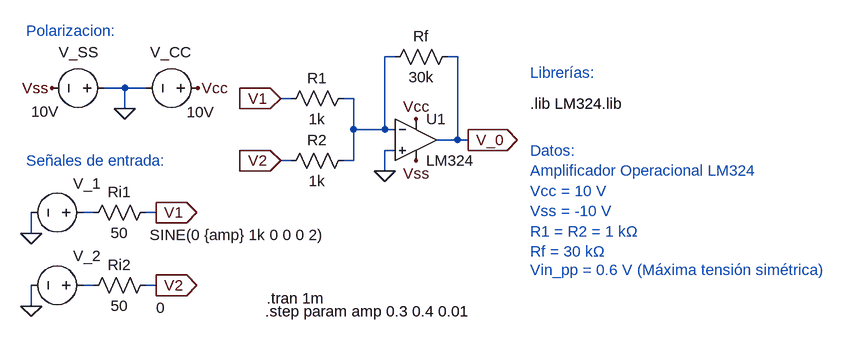
[diagram p0: schematic Lab_2_Circ_1_Ri=50+Barrido Distorsion.asc]
Lab_2_Circ_1_Ri=50+Barrido Distorsion.asc, the LTspice schematic file:
Version 4
SHEET 1 2792 680
WIRE 448 -304 432 -304
WIRE 544 -304 528 -304
WIRE 32 -256 0 -256
WIRE 64 -256 32 -256
WIRE 288 -240 272 -240
WIRE 384 -240 368 -240
WIRE 32 -224 32 -256
WIRE 384 -192 384 -240
WIRE 432 -192 432 -304
WIRE 432 -192 384 -192
WIRE 448 -192 432 -192
WIRE 544 -176 544 -304
WIRE 544 -176 512 -176
WIRE 560 -176 544 -176
WIRE 448 -160 432 -160
WIRE 288 -144 272 -144
WIRE 384 -144 384 -192
WIRE 384 -144 368 -144
WIRE 432 -128 432 -160
WIRE -16 -64 -32 -64
WIRE 80 -64 64 -64
WIRE -112 -32 -112 -64
WIRE -16 48 -32 48
WIRE 80 48 64 48
WIRE -112 80 -112 48
FLAG 432 -128 0
FLAG 144 -256 Vcc
FLAG 480 -208 Vcc
FLAG -80 -256 Vss
FLAG 480 -144 Vss
FLAG 32 -224 0
FLAG -112 -32 0
FLAG 272 -240 V1
IOPIN 272 -240 In
FLAG 80 -64 V1
IOPIN 80 -64 Out
FLAG 272 -144 V2
IOPIN 272 -144 In
FLAG 560 -176 V_0
IOPIN 560 -176 Out
FLAG -112 80 0
FLAG 80 48 V2
IOPIN 80 48 Out
SYMBOL OpAmps\\opamp2 480 -240 R0
SYMATTR InstName U1
SYMATTR Value LM324
SYMBOL res -32 -48 R270
WINDOW 0 32 56 VTop 2
WINDOW 3 0 56 VBottom 2
SYMATTR InstName Ri1
SYMATTR Value 50
SYMBOL voltage -16 -64 M270
WINDOW 0 45 31 VLeft 2
WINDOW 3 -34 -86 VLeft 2
WINDOW 123 -35 -94 VLeft 2
WINDOW 39 0 0 Left 0
SYMATTR InstName V_1
SYMATTR Value SINE(0 {amp} 1k 0 0 0 2)
SYMBOL voltage 160 -256 R90
WINDOW 0 -55 25 VRight 2
WINDOW 3 37 -10 VRight 2
WINDOW 123 0 0 Left 0
WINDOW 39 0 0 Left 0
SYMATTR InstName V_CC
SYMATTR Value 10V
SYMBOL voltage 16 -256 R90
WINDOW 0 -55 25 VRight 2
WINDOW 3 36 85 VRight 2
WINDOW 123 0 0 Left 0
WINDOW 39 0 0 Left 0
SYMATTR InstName V_SS
SYMATTR Value 10V
SYMBOL res -32 64 R270
WINDOW 0 32 56 VTop 2
WINDOW 3 0 56 VBottom 2
SYMATTR InstName Ri2
SYMATTR Value 50
SYMBOL voltage -16 48 M270
WINDOW 0 45 31 VLeft 2
WINDOW 3 -35 -96 VLeft 2
WINDOW 123 0 0 Left 0
WINDOW 39 0 0 Left 0
SYMATTR InstName V_2
SYMATTR Value 0
SYMBOL res 384 -256 R90
WINDOW 0 0 56 VBottom 2
WINDOW 3 32 56 VTop 2
SYMATTR InstName R1
SYMATTR Value 1k
SYMBOL res 384 -160 R90
WINDOW 0 0 56 VBottom 2
WINDOW 3 32 56 VTop 2
SYMATTR InstName R2
SYMATTR Value 1k
SYMBOL res 544 -320 R90
WINDOW 0 0 56 VBottom 2
WINDOW 3 32 56 VTop 2
SYMATTR InstName Rf
SYMATTR Value 30k
TEXT 656 -232 Left 2 !.lib LM324.lib
TEXT 656 -280 Left 2 ;Librerías:
TEXT -120 -344 Left 2 ;Polarizacion:
TEXT -120 -144 Left 2 ;Señales de entrada:
TEXT 656 -160 Left 2 ;Datos:\nAmplificador Operacional LM324\nVcc = 10 V\nVss = -10 V\nR1 = R2 = 1 kΩ\nRf = 30 kΩ
TEXT 248 88 Left 2 !.step param amp 0.3 0.4 0.01
TEXT 656 24 Left 2 ;Vin_pp = 0.6 V (Máxima tensión simétrica)
TEXT 250 68 Left 2 !.tran 1m

The netlist it stands for:
* Lab_2_Circ_1_Ri=50+Barrido Distorsion.asc
XU1 0 N001 Vcc Vss V_0 LM324  ; pins In+ In- V+ V- OUT
Ri1 N002 V1 50
V_1 N002 0 SINE(0 {amp} 1k 0 0 0 2)
V_CC Vcc 0 10V
V_SS 0 Vss 10V
Ri2 N003 V2 50
V_2 N003 0 0
R1 N001 V1 1k
R2 N001 V2 1k
Rf V_0 N001 30k
.lib LM324.lib
* Librerías:
* Polarizacion:
* Señales de entrada:
* Datos:
* Amplificador Operacional LM324
* Vcc = 10 V
* Vss = -10 V
* R1 = R2 = 1 kΩ
* Rf = 30 kΩ
.step param amp 0.3 0.4 0.01
* Vin_pp = 0.6 V (Máxima tensión simétrica)
.tran 1m
.backanno
.end

* Results of the author's LTspice run, read from the files saved beside the schematic
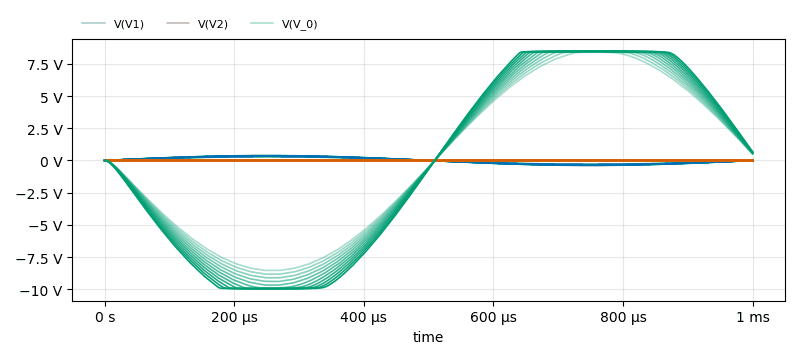
[diagram p1: Transient Analysis of Lab_2_Circ_1_Ri=50+Barrido Distorsion.asc, plotted from the saved traces]
* Transient Analysis, 11 runs:
*   V(V1) [run 1]: min -285.8 mV, max 285.7 mV, average -57.33 µV, rms 202.1 mV, last 407.1 µV
*   V(V1) [run 2]: min -295.6 mV, max 295.3 mV, average -93.84 µV, rms 208.8 mV, last 420.8 µV
*   V(V1) [run 3]: min -305.3 mV, max 304.8 mV, average -130.6 µV, rms 215.6 mV, last 434.5 µV
*   V(V1) [run 4]: min -315.1 mV, max 314.2 mV, average -168.7 µV, rms 222.4 mV, last 448.2 µV
*   V(V1) [run 5]: min -324.7 mV, max 323.8 mV, average -209.5 µV, rms 229.2 mV, last 462 µV
*   V(V1) [run 6]: min -334.5 mV, max 333.4 mV, average -199.7 µV, rms 236 mV, last 475.7 µV
*   V(V1) [run 7]: min -344.3 mV, max 343.1 mV, average -212.8 µV, rms 242.9 mV, last 489.4 µV
*   V(V1) [run 8]: min -354.1 mV, max 352.9 mV, average -226 µV, rms 249.7 mV, last 503.2 µV
*   V(V2) [run 1]: min -411.2 µV, max 407.1 µV, average -10.91 µV, rms 286.2 µV, last 407.1 µV
*   V(V2) [run 2]: min -424.9 µV, max 420.8 µV, average -28.35 µV, rms 304.7 µV, last 420.8 µV
*   V(V2) [run 3]: min -569.2 µV, max 434.5 µV, average -53.05 µV, rms 336.7 µV, last 434.5 µV
*   V(V2) [run 4]: min -797 µV, max 448.2 µV, average -82.99 µV, rms 382.5 µV, last 448.2 µV
*   V(V2) [run 5]: min -1.024 mV, max 462 µV, average -117.1 µV, rms 440 µV, last 462 µV
*   V(V2) [run 6]: min -1.254 mV, max 475.7 µV, average -151.9 µV, rms 506.9 µV, last 475.7 µV
*   V(V2) [run 7]: min -1.486 mV, max 489.4 µV, average -178.4 µV, rms 583.8 µV, last 489.4 µV
*   V(V2) [run 8]: min -1.717 mV, max 514.6 µV, average -199.8 µV, rms 671.6 µV, last 503.2 µV
*   V(V_0) [run 1]: min -8.534 V, max 8.407 V, average -12.52 mV, rms 6.038 V, last 496.6 mV
*   V(V_0) [run 2]: min -8.819 V, max 8.433 V, average -33.25 mV, rms 6.211 V, last 513.3 mV
*   V(V_0) [run 3]: min -9.103 V, max 8.446 V, average -63.05 mV, rms 6.373 V, last 530 mV
*   V(V_0) [run 4]: min -9.393 V, max 8.455 V, average -99.37 mV, rms 6.527 V, last 546.8 mV
*   V(V_0) [run 5]: min -9.678 V, max 8.461 V, average -140.8 mV, rms 6.675 V, last 563.5 mV
*   V(V_0) [run 6]: min -9.896 V, max 8.466 V, average -184.6 mV, rms 6.817 V, last 580.3 mV
*   V(V_0) [run 7]: min -9.929 V, max 8.47 V, average -217.4 mV, rms 6.934 V, last 597.1 mV
*   V(V_0) [run 8]: min -9.943 V, max 8.474 V, average -243.8 mV, rms 7.035 V, last 613.8 mV